# Altium schematic sheet LCD.SchDoc
size A3; SheetNumber: 5; SheetTotal: 6
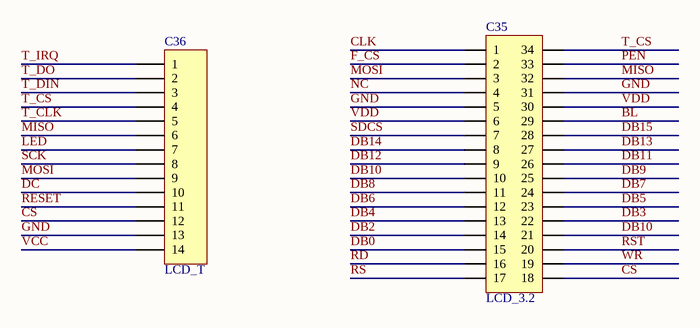
[diagram p0: LCD.SchDoc]

## Parts
C35  LCD_3.2  [JP17-C2T]
C36  LCD_T  [JP14-C1T]

## Nets
BL: C35.29
CLK: C35.1
CS: C35.18 C36.12
DB0: C35.15
DB2: C35.14
DB3: C35.22
DB4: C35.13
DB5: C35.23
DB6: C35.12
DB7: C35.24
DB8: C35.11
DB9: C35.25
DB10: C35.10 C35.21
DB11: C35.26
DB12: C35.9
DB13: C35.27
DB14: C35.8
DB15: C35.28
DC: C36.10
F_CS: C35.2
GND: C35.5 C35.31 C36.13
LED: C36.7
MISO: C35.32 C36.6
MOSI: C35.3 C36.9
NC: C35.4
PEN: C35.33
RD: C35.16
RESET: C36.11
RS: C35.17
RST: C35.20
SCK: C36.8
SDCS: C35.7
T_CLK: C36.5
T_CS: C35.34 C36.4
T_DIN: C36.3
T_DO: C36.2
T_IRQ: C36.1
VCC: C36.14
VDD: C35.6 C35.30
WR: C35.19

## Library data of the parts
C35 = JP17x2: WR-PHD 2.54 mm Dual Socket Header; Manufacturer: W¨¹rth Elektronik eiSos GmbH; partNo: 61303421821; ComponentLink1 Description: Manufacturer; ComponentLink2 Description: Datasheet; NoPins: 34; Created Date: 29 March 2013; ComponentLink1URL: http://www.we-online.com; ComponentLink2URL: http://katalog.we-online.de/em/datasheet/6130xx21821.pdf; Created by: Karrer Zheng
C36 = JP14: WR-PHD 2.54 mm Angled Socket Header; Manufacturer: W¨¹rth Elektronik eiSos GmbH; partNo: 613014143121; ComponentLink1 Description: Manufacturer; ComponentLink2 Description: Datasheet; NoPins: 14; Created Date: 29 March 2013; ComponentLink1URL: http://www.we-online.com; ComponentLink2URL: http://katalog.we-online.de/em/datasheet/6130xx143121.pdf; Created by: Karrer Zheng